# EAGLE board MaTouch ESP32-S3 7.5“ Eink AI Mic Array V1.0 (EAGLE 6.1)
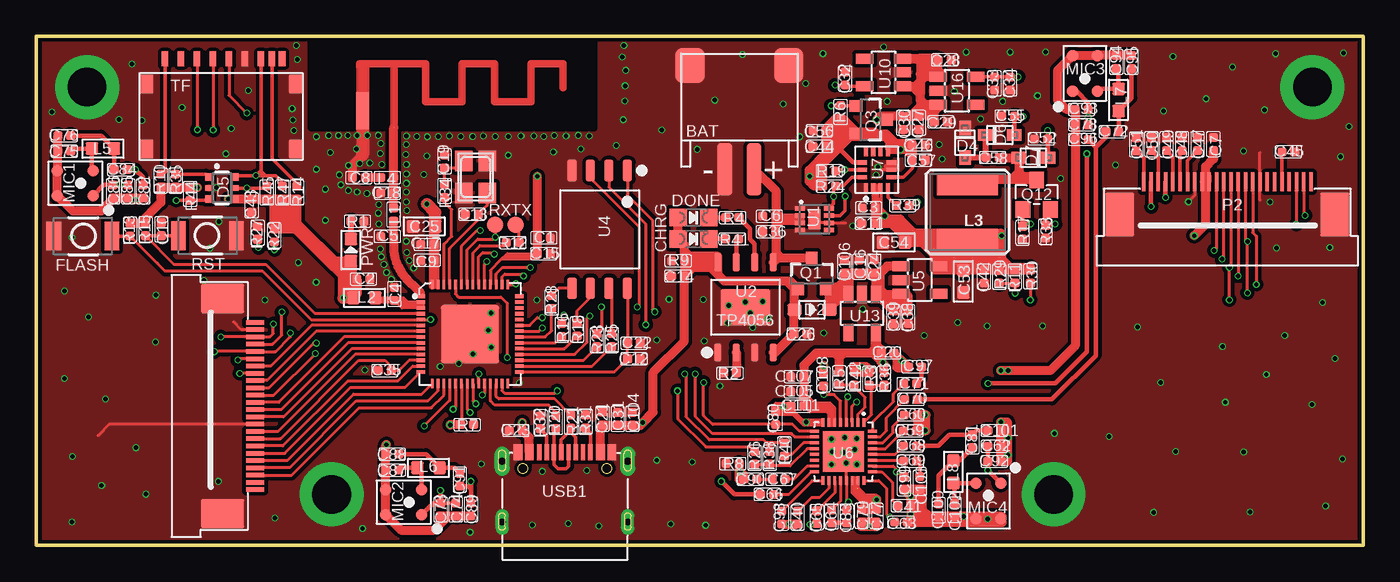
[diagram p3: board, top side]
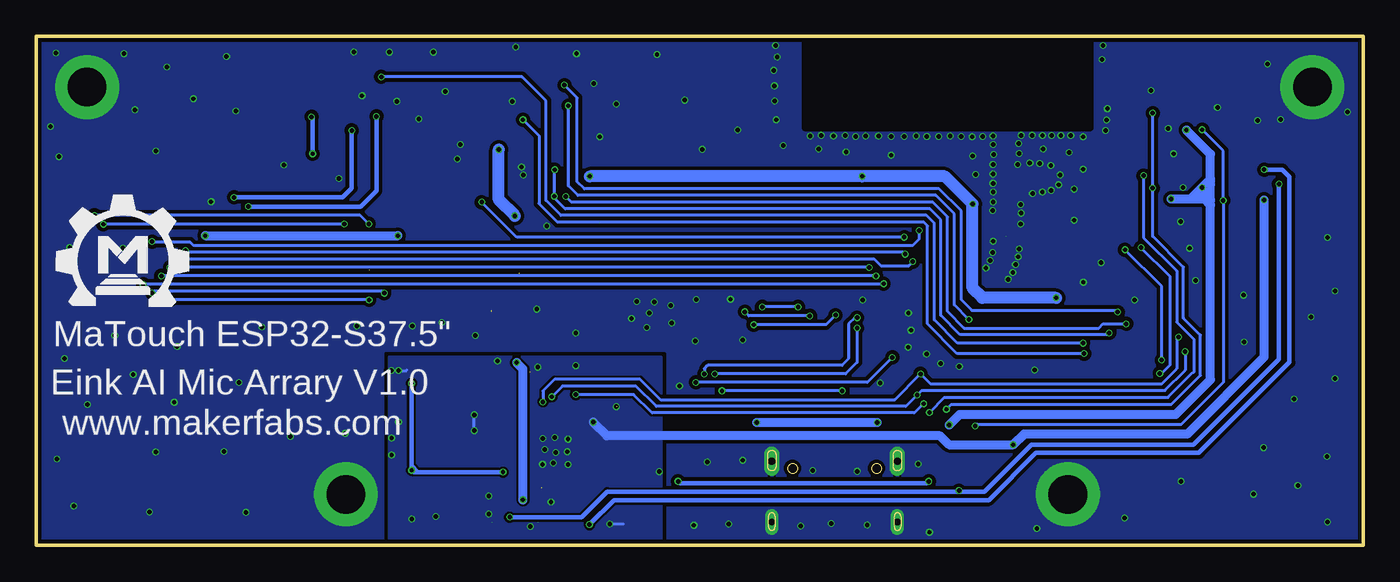
[diagram p4: board, bottom side, seen from below]

Size 91.3 x 35 mm. Coordinates in mm from the lower left corner, seen from the top.
Outline: 0,0 91.3,0 91.3,35 0,35 0,0
Copper layers (1*16): Top 0.035mm / dielectric 1.5mm / Bottom 0.035mm
Design rules: minimum track width 6mil, minimum drill 10mil, track to track 6mil, track to pad 6mil, pad to pad 6mil, via to via 6mil, smd to smd 0mil, copper to edge 10mil, drill to drill 10mil, minimum pad ring 3mil, minimum via ring 3mil, stop-mask expansion 2mil, vias tented up to drill 100mil, thermal gap 0mil
Net classes: 0 default: width 0.203 mm, drill 0.305 mm, clearance 0.152 mm; 1 vbat: width 0.254 mm, drill 0.305 mm, clearance 0.203 mm
tRestrict: area 18.9,28.7 to 38.4,36.3
bRestrict: area 18.8,28.7 to 38.4,36.3

## Footprints (pad centres in the part's own frame; a part is rotated, then mirrored left to right if it is on the bottom)
RN-ANT = smd 0.025 x 0.025: FEED 0,2.159 | smd 2.54 x 0.889: GND -1.143,0
HW2-SMD-2.0-90D = smd 2 x 2.4: 3 3.4,-2.181; 4 -3.4,-2.181 | smd 1 x 3.6: + -1,4.953; - 1,4.953
DISCRETE_C0402 = smd 0.635 x 0.635: 1 -0.445,0; 2 0.445,0
DISCRETE_C0603 = smd 0.889 x 0.889: 1 -0.762,0; 2 0.762,0
C0603 = smd 0.889 x 0.889: 1 -0.762,0; 2 0.762,0
CHIPLED_0805_NOOUTLINE = smd 1.2 x 1.2: A 0,-1.05; C 0,1.05
SOD323 = smd 1 x 0.8: + -1.2,0; - 1.2,0
SOD-323F = smd 1 x 0.8: A -1,0; C 1,0
SOT363 = smd 0.5 x 0.5: 1 -0.75,-0.9; 3 0.75,-0.9; 4 0.75,0.9; 6 -0.75,0.9 | smd 0.4 x 0.5: 2 0,-0.9; 5 0,0.9
157SW = smd 1.016 x 1.981: 1 0,0; 2 4,0
SMD26-50P-1760L450W = smd 0.3 x 1.3: 1 5.75,0; 2 5.25,0; 3 4.75,0; 4 4.25,0; 5 3.75,0; 6 3.25,0; 7 2.75,0; 8 2.25,0; 9 1.75,0; 10 1.25,0; 11 0.75,0; 12 0.25,0; 13 -0.25,0; 14 -0.75,0; 15 -1.25,0; 16 -1.75,0; 17 -2.25,0; 18 -2.75,0; 19 -3.25,0; 20 -3.75,0; 21 -4.25,0; 22 -4.75,0; 23 -5.25,0; 24 -5.75,0 | smd 2 x 3: 25 -7.4,-2.25; 26 7.4,-2.25
DISCRETE_L0402 = smd 0.635 x 0.635: 1 -0.445,0; 2 0.445,0
DISCRETE_L0603 = smd 0.889 x 0.889: 1 -0.762,0; 2 0.762,0
CR54 = smd 4.2 x 1.4: P$1 0,1.85; P$2 0,-1.85
L0603 = smd 0.889 x 0.889: 1 -0.762,0; 2 0.762,0
MIC4-SMD-3.76X2.95MM = smd 0.8 x 0.8: 1 0.85,1.23; 2 0.85,-1.23; 3 -0.85,-1.23; 4 -0.85,1.23
DISCRETE_LED-0603 = smd 0.889 x 0.889: + -0.762,0; - 0.762,0
SOT23-3 = smd 0.8 x 0.9: 1 -0.95,-1; 2 0.95,-1; 3 0,1.1
SOT23 = smd 1.016 x 1.143: 1 -0.95,-1.016; 2 0.95,-1.016; 3 0,1.016
DISCRETE_R0402 = smd 0.635 x 0.635: 1 -0.445,0; 2 0.445,0
TP-D45MIL = smd 1.143 x 1.143: T 0,0
ONEPIN01 = drill 2.65 pad 4.4: 1 0,0
TF-018 = smd 1 x 1.3: 1 -5.15,2.225; 2 -5.15,-2.225; 3 5.15,-2.225; 4 5.15,2.225 | smd 0.5 x 1: G1 -4.2,-3.975; P1 3.85,-3.975; P2 2.75,-3.975; P3 1.65,-3.975; P4 0.55,-3.975; P5 -0.55,-3.975; P6 -1.65,-3.975; P7 -2.75,-3.975; P8 -3.5,-3.975
DFN-8 = smd 0.3 x 0.7: 1 -0.75,-0.99; 2 -0.25,-0.99; 3 0.25,-0.99; 4 0.75,-0.99; 5 0.75,0.99; 6 0.25,0.99; 7 -0.25,0.99; 8 -0.75,0.99 | smd 1.38 x 0.8: 9 0,0
SOP8-1.27P = smd 1.27 x 0.51: 1 -3.1,1.905; 2 -3.1,0.635; 3 -3.1,-0.635; 4 -3.1,-1.905; 5 3.1,-1.905; 6 3.1,-0.635; 7 3.1,0.635; 8 3.1,1.905 | smd 2.5 x 3.4: 9 0,0
QFN56-7*7MM = smd 0.6 x 0.2: 1 -3.4,2.6; 2 -3.4,2.2; 3 -3.4,1.8; 4 -3.4,1.4; 5 -3.4,1; 6 -3.4,0.6; 7 -3.4,0.2; 8 -3.4,-0.2; 9 -3.4,-0.6; 10 -3.4,-1; 11 -3.4,-1.4; 12 -3.4,-1.8; 13 -3.4,-2.2; 14 -3.4,-2.6; 29 3.4,-2.6; 30 3.4,-2.2; 31 3.4,-1.8; 32 3.4,-1.4; 33 3.4,-1; 34 3.4,-0.6; 35 3.4,-0.2; 36 3.4,0.2; 37 3.4,0.6; 38 3.4,1; 39 3.4,1.4; 40 3.4,1.8; 41 3.4,2.2; 42 3.4,2.6 | smd 0.2 x 0.6: 15 -2.6,-3.4; 16 -2.2,-3.4; 17 -1.8,-3.4; 18 -1.4,-3.4; 19 -1,-3.4; 20 -0.6,-3.4; 21 -0.2,-3.4; 22 0.2,-3.4; 23 0.6,-3.4; 24 1,-3.4; 25 1.4,-3.4; 26 1.8,-3.4; 27 2.2,-3.4; 28 2.6,-3.4; 43 2.6,3.4; 44 2.2,3.4; 45 1.8,3.4; 46 1.4,3.4; 47 1,3.4; 48 0.6,3.4; 49 0.2,3.4; 50 -0.2,3.4; 51 -0.6,3.4; 52 -1,3.4; 53 -1.4,3.4; 54 -1.8,3.4; 55 -2.2,3.4; 56 -2.6,3.4 | smd 4 x 4: 57 0,0
SOIC-8-208MIL = smd 1.5 x 0.635: 1 -4.05,1.905; 2 -4.05,0.635; 3 -4.05,-0.635; 4 -4.05,-1.905; 5 4.05,-1.905; 6 4.05,-0.635; 7 4.05,0.635; 8 4.05,1.905
SOT23-5 = smd 0.69 x 1.2: 1 -0.95,-1.3; 2 0,-1.3; 3 0.95,-1.3; 4 0.95,1.3; 5 -0.95,1.3
QFN33-40P400L400W75H-280X280 = smd 0.2 x 0.6: 1 -1.4,-2; 2 -1,-2; 3 -0.6,-2; 4 -0.2,-2; 5 0.2,-2; 6 0.6,-2; 7 1,-2; 8 1.4,-2; 17 1.4,2; 18 1,2; 19 0.6,2; 20 0.2,2; 21 -0.2,2; 22 -0.6,2; 23 -1,2; 24 -1.4,2 | smd 0.6 x 0.2: 9 2,-1.4; 10 2,-1; 11 2,-0.6; 12 2,-0.2; 13 2,0.2; 14 2,0.6; 15 2,1; 16 2,1.4; 25 -2,1.4; 26 -2,1; 27 -2,0.6; 28 -2,0.2; 29 -2,-0.2; 30 -2,-0.6; 31 -2,-1; 32 -2,-1.4 | smd 2.8 x 2.8: 33 0,0
LGA14-50P-300L250W86H = smd 0.675 x 0.28: 1 -1.262,0.75; 2 -1.262,0.25; 3 -1.262,-0.25; 4 -1.262,-0.75; 8 1.262,-0.75; 9 1.262,-0.25; 10 1.262,0.25; 11 1.262,0.75 | smd 0.28 x 0.675: 5 -0.5,-1.012; 6 0,-1.012; 7 0.5,-1.012; 12 0.5,1.012; 13 0,1.012; 14 -0.5,1.012
TYPE-C-31-M-12 = smd 0.3 x 1.1: A5 -1.25,0.05; A6 -0.25,0.05; A7 0.25,0.05; A8 1.25,0.05; B5 1.75,0.05; B6 0.75,0.05; B7 -0.75,0.05; B8 -1.75,0.05 | smd 0.6 x 1.1: GND -3.225,0.05; GND2 3.225,0.05; VBUS1 -2.45,0.05; VBUS2 2.45,0.05 | drill 0.5 pad 1.016 long: P$1 4.32,-0.57; P$2 -4.32,-0.57 | drill 0.45 pad 0.9 long: P$3 -4.32,-4.75; P$4 4.32,-4.75
NX3225 = smd 1.4 x 1.2: 1 -1.1,-0.8; 2 1.1,-0.8; 3 1.1,0.8; 4 -1.1,0.8

## Placement (x,y rotation side)
ANT1  ANTENNA  [RN-ANT]  22.45,28.73 270 top
BAT  JST-2P  [HW2-SMD-2.0-90D]  48.38,30.82 180 top
C1  0.1uF  [DISCRETE_C0402]  34.92,21.14 180 top
C2  0.1uF  [DISCRETE_C0402]  22.5,18.3 180 top
C3  10uF  [DISCRETE_C0402]  57.28,23.2 0 top
C4  0.1uF  [DISCRETE_C0402]  24.64,17.28 270 top
C5  NC  [DISCRETE_C0402]  24.15,21.24 0 top
C6  10uF  [DISCRETE_C0402]  50.43,22.63 180 top
C7  10uF  [DISCRETE_C0402]  81,27.59 270 top
C8  NC  [DISCRETE_C0402]  22.2,25.28 0 top
C9  0.1uF  [DISCRETE_C0402]  26.9,19.59 0 top
C10  0.1uF  [DISCRETE_C0402]  8.61,21.73 270 top
C11  0.1uF  [DISCRETE_C0402]  57.25,22.13 0 top
C12  0.1uF  [DISCRETE_C0402]  41.12,12.82 180 top
C13  12pF  [DISCRETE_C0402]  29.97,22.77 0 top
C14  10uF  [DISCRETE_C0402]  44.15,18.52 180 top
C15  0.1uF  [DISCRETE_C0402]  34.92,20.05 180 top
C16  0.1uF  [DISCRETE_C0402]  56.64,19.16 270 top
C17  0.1uF  [DISCRETE_C0402]  26.9,20.68 0 top
C18  NC  [DISCRETE_C0402]  24.15,24.21 0 top
C19  12pF  [DISCRETE_C0402]  28.09,26.4 90 top
C20  0.1uF  [DISCRETE_C0402]  58.57,13.22 0 top
C21  0.1uF  [DISCRETE_C0402]  38.96,8.7 90 top
C22  1uF/25V  [DISCRETE_C0402]  41.12,13.89 0 top
C23  0.1uF  [DISCRETE_C0402]  32.99,7.89 180 top
C24  10uF  [DISCRETE_C0402]  57.65,19.16 270 top
C25  10uF  [DISCRETE_C0603]  26.69,21.93 0 top
C26  0.1uF  [DISCRETE_C0402]  52.57,14.53 180 top
C27  0.1uF  [DISCRETE_C0402]  60.73,29.05 90 top
C28  10uF  [DISCRETE_C0402]  62.5,33.38 180 top
C29  0.1uF  [DISCRETE_C0402]  62.25,29.11 180 top
C30  10uF  [DISCRETE_C0402]  59.66,29.05 90 top
C31  10uF  [DISCRETE_C0402]  40.01,8.69 270 top
C32  0.1uF  [DISCRETE_C0402]  55.65,32.09 270 top
C33  10uF  [DISCRETE_C0402]  65.94,31.77 90 top
C34  0.1uF  [DISCRETE_C0402]  67,31.77 90 top
C35  15pF  [DISCRETE_C0402]  23.98,12.01 0 top
C36  0.1uF  [DISCRETE_C0402]  50.43,21.57 180 top
C38  10uF  [DISCRETE_C0402]  59.99,15.68 90 top
C39  10uF  [DISCRETE_C0402]  58.96,15.67 270 top
C40  1uF  [DISCRETE_C0402]  52.39,1.9 270 top
C41  1uF  [DISCRETE_C0402]  59.73,2.71 0 top
C42  10uF  [DISCRETE_C0402]  65.21,18.47 90 top
C43  0.1uF  [DISCRETE_C0402]  14.81,23.37 90 top
C44  10uF  [DISCRETE_C0402]  53.88,27.43 0 top
C45  1uF/25V  [DISCRETE_C0402]  86.15,27.06 0 top
C46  1uF/25V  [DISCRETE_C0402]  60.71,27.52 0 top
C47  1uF/25V  [DISCRETE_C0402]  79.9,27.58 90 top
C48  1uF/25V  [DISCRETE_C0402]  78.84,27.58 90 top
C49  1uF/25V  [DISCRETE_C0402]  77.77,27.58 90 top
C50  1uF/25V  [DISCRETE_C0402]  76.73,27.58 90 top
C51  1uF/25V  [DISCRETE_C0402]  75.69,27.56 90 top
C52  1uF/25V  [DISCRETE_C0402]  69.14,27.94 180 top
C53  10uF/25V  [C0603]  63.78,18.14 270 top
C54  10uF/25V  [C0603]  59.01,20.82 180 top
C55  1uF/25V  [DISCRETE_C0402]  66.87,29.51 180 top
C56  0.1uF  [DISCRETE_C0402]  53.89,28.52 0 top
C57  10uF  [DISCRETE_C0402]  60.71,26.48 180 top
C58  1uF/25V  [DISCRETE_C0402]  65.81,26.67 0 top
C59  1uF  [DISCRETE_C0402]  60.11,7.87 0 top
C60  1uF  [DISCRETE_C0402]  60.16,8.96 0 top
C62  1uF  [DISCRETE_C0402]  65.92,6.8 180 top
C63  1uF  [DISCRETE_C0402]  59.5,1.59 180 top
C64  1uF  [DISCRETE_C0402]  54.72,1.97 90 top
C65  1uF  [DISCRETE_C0402]  53.71,1.92 90 top
C66  1uF  [DISCRETE_C0402]  50.29,3.5 0 top
C67  1uF  [DISCRETE_C0402]  51.09,4.54 0 top
C68  1uF  [DISCRETE_C0402]  60.13,6.83 180 top
C69  1uF  [DISCRETE_C0402]  60.13,5.78 180 top
C70  1uF  [DISCRETE_C0402]  60.19,10.03 180 top
C71  1uF  [DISCRETE_C0402]  60.13,11.12 180 top
C72  1uF  [DISCRETE_C0402]  74.04,28.44 0 top
C73  10uF  [DISCRETE_C0402]  27.82,2.45 270 top
C74  100nF  [DISCRETE_C0402]  28.86,2.45 270 top
C75  33pF  [DISCRETE_C0402]  1.92,27.1 180 top
C76  33pF  [DISCRETE_C0402]  1.92,28.17 180 top
C77  1uF  [DISCRETE_C0402]  57.8,2.02 270 top
C78  10uF  [DISCRETE_C0402]  71.93,28.92 180 top
C79  1uF  [DISCRETE_C0402]  56.79,2.02 270 top
C80  33pF  [DISCRETE_C0402]  50.87,8.75 90 top
C81  1uF  [DISCRETE_C0402]  64.42,7.15 270 top
C82  33pF  [DISCRETE_C0402]  7.36,24.33 270 top
C83  33pF  [DISCRETE_C0402]  55.77,1.97 90 top
C84  1uF  [DISCRETE_C0402]  5.81,25.83 180 top
C85  10uF  [DISCRETE_C0402]  6.32,24.33 270 top
C86  100nF  [DISCRETE_C0402]  5.27,24.33 270 top
C87  33pF  [DISCRETE_C0402]  24.49,5.17 180 top
C88  33pF  [DISCRETE_C0402]  24.49,6.26 180 top
C89  33pF  [DISCRETE_C0402]  29.9,2.45 270 top
C90  33pF  [DISCRETE_C0402]  49.14,4.54 180 top
C91  1uF  [DISCRETE_C0402]  29.14,4.51 90 top
C92  10uF  [DISCRETE_C0402]  65.92,5.75 0 top
C93  100nF  [DISCRETE_C0402]  71.93,29.96 180 top
C94  33pF  [DISCRETE_C0402]  74.32,33.24 90 top
C95  33pF  [DISCRETE_C0402]  75.36,33.24 90 top
C96  33pF  [DISCRETE_C0402]  71.93,27.9 180 top
C97  33pF  [DISCRETE_C0402]  60.47,12.26 180 top
C98  1uF  [DISCRETE_C0402]  51.3,1.9 270 top
C99  100nF  [DISCRETE_C0402]  59.7,4.26 270 top
C100  33pF  [DISCRETE_C0402]  62.09,2.4 270 top
C101  33pF  [DISCRETE_C0402]  65.92,7.89 0 top
C102  33pF  [DISCRETE_C0402]  63.18,2.43 270 top
C103  33pF  [DISCRETE_C0402]  60.8,4.29 270 top
C104  10uF  [DISCRETE_C0402]  41.01,8.69 90 top
C105  10uF  [DISCRETE_C0402]  52.36,10.55 180 top
C106  0.1uF  [DISCRETE_C0402]  55.61,19.18 90 top
C107  0.1uF  [DISCRETE_C0402]  52.36,11.6 180 top
C108  33pF  [DISCRETE_C0402]  54.17,11.4 90 top
C111  0.1uF  [DISCRETE_C0402]  52.37,9.56 180 top
CHRG  RED  [CHIPLED_0805_NOOUTLINE]  45.21,21.06 270 top
D2  B5819WS  [SOD323]  53.37,16.19 0 top
D4  MBR0530  [SOD-323F]  63.9,27.68 90 top
D5  SMF05C  [SOT363]  12.78,24.57 270 top
D6  MBR0530  [SOD-323F]  66.3,28.21 180 top
D7  MBR0530  [SOD-323F]  68.61,26.65 0 top
DONE  GREEN  [CHIPLED_0805_NOOUTLINE]  45.21,22.53 270 top
FLASH  BUTTON  [157SW]  1.21,21.26 0 top
J5  [SMD26-50P-1760L450W]  15.06,9.57 270 top
L1  0R  [DISCRETE_L0402]  24.58,22.74 270 top
L2  2nH  [DISCRETE_L0603]  22.57,17.02 0 top
L3  47µH/±30%/1A  [CR54]  64.08,22.92 180 top
L4  NC  [DISCRETE_L0402]  24.15,25.28 0 top
L5  BLM18BD252SN1  [L0603]  4.59,27.28 0 top
L6  BLM18BD252SN1  [L0603]  26.98,5.32 0 top
L7  BLM18BD252SN1  [L0603]  74.47,30.62 270 top
L8  BLM18BD252SN1  [L0603]  63.1,5.04 90 top
MIC1  SAO-3729-M-42-008  [MIC4-SMD-3.76X2.95MM]  2.68,24.89 270 top
MIC2  SAO-3729-M-42-008  [MIC4-SMD-3.76X2.95MM]  25.28,2.96 270 top
MIC3  SAO-3729-M-42-008  [MIC4-SMD-3.76X2.95MM]  72.16,32.45 180 top
MIC4  SAO-3729-M-42-008  [MIC4-SMD-3.76X2.95MM]  65.52,3.04 0 top
P2  [SMD26-50P-1760L450W]  81.95,25 0 top
PWR  [DISCRETE_LED-0603]  21.64,20.3 90 top
Q1  MOSFET-PCHANNEL  [SOT23-3]  53.35,18.64 0 top
Q3  MOSFET-PCHANNEL  [SOT23-3]  57.39,29.26 270 top
Q12  SI1308EDL  [SOT23]  68.83,24.11 0 top
R1  470R  [DISCRETE_R0402]  22.1,22.28 180 top
R2  1.2K  [DISCRETE_R0402]  47.73,11.84 0 top
R3  0R  [DISCRETE_R0402]  57.32,11.45 270 top
R4  1.2K  [DISCRETE_R0402]  47.9,22.53 180 top
R5  NC  [DISCRETE_R0402]  55.26,11.47 270 top
R6  10K  [DISCRETE_R0402]  55.34,29.8 270 top
R7  0R  [DISCRETE_R0402]  29.64,8.29 0 top
R8  0R  [DISCRETE_R0402]  47.92,5.61 180 top
R9  100K  [DISCRETE_R0402]  44.16,19.56 0 top
R10  10K  [DISCRETE_R0402]  8.56,25.07 270 top
R11  NC  [DISCRETE_R0402]  67.33,18.47 90 top
R12  499R  [DISCRETE_R0402]  32.79,20.81 180 top
R13  10K  [DISCRETE_R0402]  6.45,21.71 90 top
R14  10K  [DISCRETE_R0402]  17.94,24.26 270 top
R15  10K  [DISCRETE_R0402]  7.52,21.73 90 top
R16  0R  [DISCRETE_R0402]  36.16,14.81 270 top
R17  10K  [DISCRETE_R0402]  67.86,21.49 270 top
R18  0R  [DISCRETE_R0402]  37.21,14.84 270 top
R19  10K  [DISCRETE_R0402]  54.56,25.74 180 top
R20  33R  [DISCRETE_R0402]  35.73,8.47 270 top
R21  33R  [DISCRETE_R0402]  36.77,8.5 270 top
R22  10K  [DISCRETE_R0402]  16.38,21.31 270 top
R23  0R  [DISCRETE_R0402]  38.58,14.09 270 top
R24  10K  [DISCRETE_R0402]  54.56,24.7 180 top
R25  0R  [DISCRETE_R0402]  39.6,14.1 270 top
R26  0R  [DISCRETE_R0402]  49.42,6.01 90 top
R27  10K  [DISCRETE_R0402]  15.23,21.49 90 top
R28  0R  [DISCRETE_R0402]  35.46,16.72 270 top
R29  10K  [DISCRETE_R0402]  66.26,18.46 270 top
R30  10K  [DISCRETE_R0402]  68.4,18.49 270 top
R31  5.1K  [DISCRETE_R0402]  37.79,8.5 90 top
R32  5.1K  [DISCRETE_R0402]  34.69,8.45 90 top
R33  2.2R  [DISCRETE_R0402]  69.44,21.56 270 top
R34  0R  [DISCRETE_R0402]  28.09,24.37 270 top
R35  10K  [DISCRETE_R0402]  9.58,25.07 270 top
R36  NC  [DISCRETE_R0402]  58.33,11.45 270 top
R38  NC  [DISCRETE_R0402]  50.46,6.01 90 top
R39  NC  [DISCRETE_R0402]  59.61,23.36 0 top
R40  0R  [DISCRETE_R0402]  51.48,6.59 90 top
R41  1.2K  [DISCRETE_R0402]  47.88,21.06 180 top
R42  0R  [DISCRETE_R0402]  56.27,11.47 270 top
R44  10K  [DISCRETE_R0402]  10.59,24.16 90 top
R45  10K  [DISCRETE_R0402]  15.85,24.26 270 top
R47  10K  [DISCRETE_R0402]  16.92,24.26 270 top
RST  BUTTON  [157SW]  13.77,21.29 180 top
RX  [TP-D45MIL]  31.57,22.03 180 top
S1  ONEPIN01  [ONEPIN01]  20.32,3.5 0 top
S2  ONEPIN01  [ONEPIN01]  3.5,31.5 0 top
S3  ONEPIN01  [ONEPIN01]  70,3.5 0 top
S4  ONEPIN01  [ONEPIN01]  87.8,31.5 0 top
TF  TF-018  [TF-018]  12.71,29.49 180 top
TX  [TP-D45MIL]  32.99,22.05 180 top
U1  MAX17048  [DFN-8]  53.54,22.42 270 top
U2  TP4056  [SOP8-1.27P]  48.8,16.36 90 top
U3  ESP32-S3  [QFN56-7*7MM]  29.85,14.52 0 top
U4  W25Q128JV  [SOIC-8-208MIL]  38.76,21.72 270 top
U5  SPX3819  [SOT23-5]  60.79,18.24 270 top
U6  ES7210  [QFN33-40P400L400W75H-280X280]  55.54,6.44 180 top
U7  [LGA14-50P-300L250W86H]  57.84,25.82 90 top
U10  SPX3819-2V8  [SOT23-5]  58.3,32.52 90 top
U13  TLV75733PDBVR  [SOT23-5]  56.82,15.94 180 top
U16  SPX3819-1V2  [SOT23-5]  63.35,31.26 270 top
U$1  [MAKERFABS_0.3]  89.46,16.47 0 bottom
USB1  TYPE-C-31-M-12  [TYPE-C-31-M-12]  36.37,6.35 0 top
X1  40MHz(10ppm)  [NX3225]  30.22,25.33 270 top

## Tracks (layer width: path | path; a pad name or v marks a point on that pad's centre or on a via)
5V  (via drill 0.3)
  Top 0.203: U2.8 46.89,19.36
  Top 0.254: C31.2
  Top 0.61: USB1.VBUS1 33.92,7.41 C23.1 v33.44,8.42 v33.43,8.43 | USB1.VBUS2 38.82,8.12 C21.1 40,8.26 C31.2 | C31.2 C104.1 41.55,8.25 v41.73,8.43 42.44,9.14 42.44,11.89 44.59,14.04 C14.1 | 51.64,18.16 51.88,18.16 Q1.1 | 51.64,18.16 47.35,18.16 46.89,18.62 | U2.4 50.86,13.26 C26.2 52.13,16.15 D2.+ 52.17,17.62 51.64,18.16 | DONE.A CHRG.A 44.61,20.62 R9.2 44.61,18.53 C14.1 | 46.89,18.62 46.89,19.36 46.89,19.86 44.96,19.86 44.6,20.22 44.6,19.66 45.03,19.23 | 46.41,19.23 46.41,19.1 | 46.41,19.1 46.89,18.62 | 46.41,19.1 46.35,19.15 45.23,19.15 C14.1
  Top 0.813: 45.03,19.23 46.41,19.23
  Bottom 0.61: v33.43,8.43 v41.73,8.43
+3V3  (via drill 0.3)  (1 unrouted)
  Top 0.203: TF.P4 v12.16,28.55 v12.17,28.55 | U3.46 31.25,18.9 32.03,19.68 | 32.21,19.86 32.39,20.05 C15.2 34.04,20.05 | U3.55 27.65,22.24 27.45,22.43 27.34,22.31 C17.2 C9.2 | U3.56 27.25,21.72 C25.2 | 34.52,19.86 32.21,19.86 | 32.21,19.86 32.03,19.68 | 32.03,19.68 34.52,19.68 34.67,19.84 | 16.38,23.76 16.43,23.82 | U3.20 29.25,8.34 R7.1 | 64.3,21.29 L3.P$1 | 57.56,24.77 57.56,24.05 | 57.56,24.05 57.56,22.61 57.56,22.45 58.29,22.45 | 58.37,22.45 58.29,22.45 | 58.29,22.45 58.01,22.73 58.01,23.39 57.91,23.5 57.91,23.67 | 57.91,23.67 57.91,24.66 57.73,24.66 57.73,24.33 57.71,24.31 | 57.56,24.79 58.12,24.79 58.12,23.88 | 58.12,23.88 58.12,22.86 58.65,22.33 | 58.12,23.88 57.91,23.67 | v59.49,27.2 59.81,27.52 C46.1 | 57.72,24.2 57.58,24.05 57.56,24.05 | 57.94,23.39 57.74,23.2 C3.2 | R10.2 8.74,24.62
  Top 0.254: D5.4 C43.2 R45.2 16.43,23.82 R47.2 R14.2 | U7.2 U7.3 57.72,24.2 C3.2 | U7.5 59.66,25.32 60.27,25.93 60.27,26.46 C57.2 C46.1 59.02,27.52 U7.8 58.6,27.1 58.6,27.84 58.12,28.31 Q3.2
  Top 0.305: 27.25,21.72 27.43,21.53 27.43,17.78 27.18,17.78 27.18,23.11 27.13,23.16 | U7.12 56.2,26.32 54.94,27.58 54.48,27.58 C44.2 | 57.94,23.39 57.94,23.29 58.9,22.33 | v58.37,22.66 58.32,22.61 57.56,22.61 | P2.16 P2.15 80.7,25.39 80.47,25.63
  Top 0.61: C2.2 22.06,17.26 L2.1 | v34.47,25.38 v34.48,25.36 C1.2 C15.2 | 21.09,16.98 v21.13,17.02 | 16.38,23.76 R22.1 17.86,21.74 20.06,19.54 | 8.74,24.62 R35.2 10.56,24.63 R44.2 v11.07,24.61 | R15.2 7.5,22.15 R13.2 7.14,22.15 8.56,23.58 R10.2 | v13.21,23.82 17.93,23.82 R14.2 | PWR.+ 20.06,19.54 | R24.2 54.12,25.25 | 54.12,25.25 R19.2 54.12,26.51 54.33,26.72 C44.2 54.33,28.51 C56.2 54.55,28.31 55.45,28.31 | v53.21,25.38 53.99,25.38 54.12,25.25 | R30.1 67.35,18.93 R11.2 66.28,18.92 R29.1 C42.2 63.8,18.91 C53.1 | C53.1 63.78,20.57 | 63.78,20.57 63.78,20.77 L3.P$1 | U5.5 63.5,19.19 C53.1 | 63.78,20.57 63.53,20.82 C54.1 59.77,21.82 59.45,22.13 C11.2 57.72,22.16 C3.2 | v66.42,21.29 64.3,21.29 | v79.68,21.29 80.47,22.07 80.47,25.63 80.47,26.04 81,26.57 C7.2 | Q3.2 55.45,28.31 | R6.2 55.34,28.43 55.45,28.31 | 54.03,24.69 53.52,24.69 53.19,25.02 53.19,25.81 54.33,26.95 54.33,28.68 55.02,29.36 55.47,29.36 56.41,28.42 57.66,28.42 57.78,28.3 58.47,28.3 59.11,27.66 60.27,27.66 60.27,26.8 | 60.27,26.47 60.27,26.8 | 60.27,26.8 59.87,27.2 v59.49,27.2 58.75,27.2 58.75,27.76 58.42,28.09 55.98,28.09 53.75,25.86 | 53.75,25.86 53.75,24.94 | 53.75,25.86 53.75,26.19 55.5,27.94 55.5,28.78 55.04,28.78 54.84,28.57 54.84,27.53 | 63.98,21.03 63.55,21.46 60.4,21.46 59.44,22.43 58.57,22.43 | 58.57,22.43 58.24,22.76 | 58.57,22.43 59.64,21.36 59.64,20.73 60.02,21.11 65.23,21.11 65.58,21.46 66.37,21.46 66.42,21.41 66.42,19.68 66.98,19.13 68.4,19.13 R30.1 61.8,18.92 61.8,19.99 60.94,20.85 61.62,20.85 62.2,20.27 65.99,20.27 65.99,19.68 66.32,19.36 62.66,19.36 62.15,19.86 65.76,19.86 65.81,19.81 | R7.1 28.48,8.29 v28.47,8.28
  Top 0.61: 20.06,19.54 21.03,18.57 | 21.03,18.57 21.03,16.99 | 21.03,18.57 21.03,19.25 20.83,19.25 17.96,22.12 17.96,23.82 17.48,23.34 17.48,22.25 16.82,22.25 16.92,22.35 16.92,23.44 17.12,23.65 17.45,23.65
  Top 0.813: C25.2 27.45,22.43 27.45,22.9 v26.88,23.47 | v21.13,17.02 L2.1 21.64,17.19 PWR.+
  Bottom 0.61: 10.52,23.39 10.52,11.38 12.9,8.99 27.76,8.99 v28.47,8.28 | 10.52,23.72 10.52,23.75 | 10.52,23.75 10.52,24.82 | 10.52,24.82 10.52,25.04 | 10.52,25.04 10.52,25.17 | 10.52,25.17 10.52,26.9 v12.17,28.55 | v11.07,24.61 10.72,24.61 10.52,24.82 | v13.21,23.82 11.86,23.82 | 10.95,23.82 10.59,23.82 10.52,23.75 | v79.68,21.29 v66.42,21.29 | 10.52,25.04 10.64,25.04 v11.07,24.61 | v11.07,24.61 11.86,23.82 | 11.86,23.82 10.95,23.82 | 10.95,23.82 10.52,23.39 | 10.52,23.39 10.52,23.72 | 10.52,23.72 11.1,24.31 11.1,24.59 10.52,25.17
  Bottom 0.813: v53.21,25.38 v34.47,25.38 28.79,25.38 v26.88,23.47 26.88,17.69 26.21,17.02 v21.13,17.02 | v58.37,22.66 59.49,23.77 v59.49,27.2
AGND  (via drill 0.3)  (4 unrouted)
  Top 0.203: U6.33 55.74,6.24 U6.21 55.74,2.92 | 55.74,2.92 55.74,2.45 C83.2 | C59.2 v61.16,7.87 | v61.16,8.97 60.63,8.97 | U6.8 52.64,8.44 51.89,9.19 | 51.89,9.19 51.38,9.19 | 51.38,9.19 C80.2 | v55.88,2.97 55.79,2.97 55.74,2.92 | v51.38,9.53 51.38,9.19 | 51.89,9.19 51.92,9.22 C111.2 | 54.1,8.26 52.78,8.26 52.07,8.97 50.65,8.97 50.65,9.55 50.88,9.78 52.09,9.78 52.15,9.73 52.15,9.2 52.7,8.64 | 52.7,8.64 54.13,8.64 | 52.7,8.64 52.58,8.64 52.05,9.17 51.16,9.17 50.8,9.53 50.93,9.65 51.56,9.65 51.56,9.32 51.36,9.53 50.98,9.53 51.13,9.37 51.46,9.37
  Top 0.305: 57.3,1.55 57.28,1.57 | 59.97,12.26 C97.2
  Top 0.61: C98.2 C40.2 52.2,1.45 v51.84,1.45 | R42.1 56.81,11.9 | 56.81,11.9 R3.1 | C77.2 57.28,1.57 C79.2 | v57.3,1.29 57.3,1.55 | C20.2 59.65,12.58 | 59.65,12.58 59.97,12.26 | C108.2 54.18,11.85 v54.18,12.34 | v56.79,12.24 56.81,12.23 56.81,11.9 | 59.65,12.58 59.65,12.59 v59.56,12.68 60.02,12.22 59.23,12.22 59.21,12.24 59.21,12.88 59,13.08 59,13.23 | 60.63,8.97 60.63,7.87 61.21,7.87 61.21,8.97 60.61,8.97 C60.2 | C92.2 C62.1 C101.2 v66.37,8.48 66.8,8.48 66.8,5.74 C92.2 | MIC4.2 MIC4.3 64.49,1.98 v63.8,1.98 C102.2 63.16,1.96 C100.2 60.31,1.96 C63.1 60.17,1.82 C41.2 60.17,3.77 60.22,3.81 | C99.2 60.22,3.81 | 60.22,3.81 60.77,3.81 C103.2 | R8.1 48.36,5.13 v48.44,5.05 | C90.2 48.69,4.8 v48.44,5.05 | C95.2 C94.2 MIC3.3 MIC3.2 70.28,32.66 70.28,30.61 70.93,29.96 C93.2 C78.2 C96.2 71.49,13.73 69.77,12.01 v66.37,12.01 | C89.2 C74.2 28.32,2 | 28.32,2 C73.2 | 28.32,2 27.36,1.04 25.12,1.04 MIC2.2 MIC2.3 C87.2 C88.2 24.05,6.88 v24.08,6.91 | C86.2 C85.2 | C85.2 6.81,23.89 | 6.81,23.89 C82.2 | v6.83,23.75 6.83,23.86 6.81,23.89 | C85.2 5.35,23.89 4.45,22.99 2.51,22.99 MIC1.2 MIC1.3 1.48,25.77 C75.2 C76.2 | 56.29,12.09 56.26,12.06 | 56.26,12.06 56.26,11.94 | 56.26,12.06 56.26,12.29 57.07,12.29 57.33,12.04 57.33,11.91 | 48.36,5.46 48.36,4.52 48.69,4.52 48.69,4.8 v48.44,5.05 | 59.94,1.57 66.45,1.57 66.45,1.98 61.42,1.98 60.98,2.41 60.98,3.86 59.69,3.86 59.69,3.83 60.15,3.38 60.58,3.38 60.58,2.03 | 56.77,1.57 56.77,1.29 57.81,1.29 C77.2
  Bottom 0.203: v61.16,7.87 v61.16,8.97 | 50.9,1.45 v51.84,1.45 | v66.37,12.01 65.84,12.01 65.81,12.04
  Bottom 0.61: v6.83,23.75 6.83,12.93 12.12,7.64 23.32,7.64 24.05,6.91 v24.08,6.91 28.5,6.91 29.11,7.52 52.05,7.52 v52.98,8.46
  other vias: 56.31,6.58 54.71,7.29 55.63,7.42 54.76,6.43 54.71,5.54 55.73,5.66 55.55,6.38 56.46,5.56 56.44,7.34 60.17,3.38 60.17,2.13 65.46,1.8 66.85,7.37 66.85,6.2 66.88,12.01
  pour Bottom: 48.29,12.93 67.03,12.93 67.03,0 48.29,0
CSI_1V2  (via drill 0.3)
  Top 0.203: J5.15 16,10.82 19.07,13.89 v19.28,13.89 | C33.2 | C34.2 | v67.56,32.21
  Top 0.254: U16.5 C33.2 C34.2 | C34.2 v67.56,32.21
  Bottom 0.203: v19.28,13.89 27.91,13.89 29.52,15.49 29.52,22.15 30.05,22.68 55.19,22.68 56.24,23.72 56.24,30.56 57.89,32.21 v67.56,32.21
CSI_2V8  (via drill 0.3)
  Top 0.203: 55.73,31.57 C32.2 | v16.89,16.03 16.89,14.45 16.26,13.82 J5.21
  Top 0.254: U10.5 55.73,31.57 | v54.97,31.65 C32.2
  Bottom 0.203: v54.97,31.65 54.08,30.76 54.08,24.99 53.59,24.51 29.18,24.51 27.66,22.99 27.66,16.89 26.92,16.15 17.02,16.15 v16.89,16.03
CSI_D0
  Top 0.203: J5.6 17.09,6.32 21.61,10.85 25.37,10.85 U3.14
CSI_D1
  Top 0.203: J5.4 15.07,5.33 17.42,5.33 22.02,9.93 26.95,9.93 27.65,10.63 U3.16
CSI_D2
  Top 0.203: J5.3 17.57,4.82 22.2,9.45 27.18,9.45 28.05,10.32 U3.17
CSI_D3
  Top 0.203: J5.5 17.25,5.82 21.82,10.39 26.52,10.39 U3.15
CSI_D4
  Top 0.203: J5.7 16.96,6.82 21.44,11.3 24.89,11.3 25.91,12.32 U3.13
CSI_D5
  Top 0.203: J5.9 16.64,7.82 21.93,13.12 U3.11
CSI_D6
  Top 0.203: U3.10 21.7,13.52 17,8.82 J5.11
CSI_D7
  Top 0.203: U3.8 21.18,14.32 16.68,9.82 J5.13
CSI_HSYNC
  Top 0.203: U3.7 19.27,14.72 15.88,11.33 J5.16
CSI_MCLK
  Top 0.203: U3.9 21.44,13.92 16.84,9.32 J5.12
CSI_PCLK
  Top 0.203: J5.8 16.8,7.32 22.19,12.72 23.98,12.72 24.42,12.28 C35.2 | C35.2 24.43,12.02 | U3.12 25.65,12.72 24.93,12.01 C35.2
CSI_RST  (via drill 0.3)
  Top 0.203: R22.2 v16.38,20.33 v16.38,20.32 | J5.19 13.96,12.82 v13.87,12.72
  Bottom 0.203: v13.87,12.72 13.87,17.8 v16.38,20.32
CSI_VSYNC
  Top 0.203: U3.6 18.93,15.12 16.13,12.32 J5.18
GDR  (via drill 0.3)
  Top 0.203: P2.2 87.2,22.78 v87.3,22.68
  Top 0.305: Q12.1 67.86,23.08 R17.1 68.03,22.1 v68.43,22.1
  Bottom 0.203: v68.43,22.1 69.01,22.68 v87.3,22.68
GND  (via drill 0.3)
  Top 0.203: 21.74,25.29 C8.1 | J5.10 5.02,8.32 4.24,7.54 | J5.23 14.11,14.82 13.56,15.37 | U3.57 30.41,14.52 v31.32,13.61 | U1.6 53.79,22.17 U1.9 | U1.6 55.7,22.17 | 84.2,27.03 84.2,27.02 84.2,25.75 P2.8 84.2,23.73 | P2.17 79.7,24.07 79.32,23.7 | v57.91,26.01 58.1,25.82 U7.6 58.95,25.82 59.2,26.08
  Top 0.305: 59.2,26.08 58.45,26.08
  Top 0.61: 22.45,26.86 21.74,26.14 21.74,25.29
  Top 0.889: ANT1.GND 22.45,26.86
  other vias: 21.49,26.11 12.52,4.39 43.66,1.45 87.78,9.68 88.49,16.69 24.43,18.29 11.53,18.21 25.5,20.14 23.93,19.3 40.49,30.56 30.02,28.12 45.9,16.89 26.67,25.5 23.55,28.19 12.4,24.61 73.81,7.47 23.55,22.83 22.76,24.18 29.21,28.12 30.76,28.14 26.9,28.09 28.42,28.14 4.75,10.06 27.66,28.12 22.07,28.17 84.63,11.73 76.89,2.26 34.24,28.14 22.61,12.04 19.89,24.49 65.43,15.09 75.77,15.01 78.38,6.45 30.05,13.16 45.14,5.71 38.71,1.32 34.82,5.08 37.87,5.13 36.6,1.5 33.35,28.14 34.92,28.12 35.59,27.05 47.57,15.29 36.45,28.14 20.85,25.48 22.07,24.28 6.58,33.1 23.75,19.84 15.72,16.87 1.07,29.79 5.69,29.29 17.91,34.37 13.06,26.92 10.03,30.1 19.28,28.09 20.12,28.17 22.25,26.26 7.26,29.21 21.44,28.17 22.78,28.19 23.77,26.19 25.45,24.28 25.45,23.6 8.2,13.97 23.57,22.1 20.95,24.79 23.57,23.44 25.96,19.08 23.7,27.64 25.43,26.87 25.68,19.58 46.05,1.37 2.49,6.1 25.45,27.56 3.58,15.7 12.57,22.25 25.48,25.53 25.45,20.9 25.48,24.89 25.48,26.19 23.67,26.95 7.54,3.51 25.48,28.14 22.02,27.25 21.46,24.41 23.67,20.37 38.05,28.14 37.29,28.19 24.1,18.75 35.64,28.17 39.9,27.48 89.36,12.85 81.61,13.67 89.89,5.92 22.94,26.29 83.08,6.4 14.61,31.27 17.65,29.24 48.77,16.74 1.93,17.48 4.5,4.11 37.47,27.25 13.41,28.65 25.5,23.01 18.03,19.43 85.9,14.43 8.23,17.2 81.81,9.83 26.19,28.12 32.49,26.82 77.37,11.2 1.93,11.46 6.86,6.71 49.99,16.76 49.3,14.96 31.57,28.12 30.63,5.59 43.54,16.92 29.84,0.89 42.7,5.84 42.7,14.12 16.41,1.88 34.14,1.4 22.45,1.14 20.8,28.17 88.72,2.69 20.24,27 26.87,26.77 2.46,1.6 49.12,15.98 40.31,33.58 47.65,16.48 45.95,14.05 32.49,28.12 70.05,7.7 83.52,2.29 2.46,21.16 50.34,15.6 54.18,14.61 56.87,16.23 61.09,14.43 69.24,15.09 63.4,15.32 56.18,21.95 46.69,30.61 51.38,30.35 43.03,28.55 54.13,33.81 48.59,33.76 58.32,34.26 58.55,30.53 57.78,25.45 62.13,27.56 62.33,26.57 63.17,31.22 63.98,33.91 67.01,33.91 68.88,30.91 69.44,33.93 66.5,30.53 64.97,29.31 70.48,25.22 74.27,26.16 79.27,23.62 83.06,27.1 78.21,33.6 77.57,29.87 82.32,32.89 80.49,30.71 85.27,33.81 90.32,28.8 89.94,33.86 89.74,26.72 84.51,29.95 89,20.47 85.34,20.45 84.89,23.6 19.25,18.08 11.94,20.42 19.89,22.35 19.28,25.86 47.04,10.95 52.53,28.09 52.93,31.75 45.47,27.23 31.29,15.98 27.79,12.29 29.08,12.5 31.11,14.78 33.22,11.15 34.44,16.87 40.39,29.26 40.51,31.6 40.56,32.66 40.44,34.37 17.73,28.52 17.6,30.02 17.96,33.4
  pour Top (isolate 0.254, rank 6): -10,50 -10,-5 100,-5 100,50
  pour Bottom (isolate 0.254, rank 6): -11,-5 101,-5 101,48 -11,48
IO0  (via drill 0.3)
  Top 0.203: R13.1 8.32,19.39 8.76,18.95 8.87,18.85 15.57,18.85 18.9,15.52 U3.5 v27.13,15.52 | 54.7,30.24 v54.69,30.23 | 56.37,30.24 Q3.1
  Top 0.254: FLASH.2 | FLASH.2 R13.1 | 54.7,30.24 R6.1 56.37,30.24
  Bottom 0.203: v54.69,30.23 54.69,24.71 54.03,24.05 29.41,24.05 28.14,22.78 28.14,16.54 v27.13,15.52
IO13  (via drill 0.3)
  Top 0.203: U3.18 28.45,9.95 v26.7,8.2 | TF.P3 11.06,28.59 v11.07,28.57 | 10.61,23.74 R44.1
  Top 0.254: D5.3 11.81,23.74 10.61,23.74 | R44.1 v9.63,23.72
  Bottom 0.203: v11.07,28.57 9.63,27.13 v9.63,23.72 9.63,11.2 12.5,8.33 26.57,8.33 v26.7,8.2
IO14  (via drill 0.3)
  Top 0.203: U3.19 28.85,9.52 v28.68,9.35 | TF.P5 13.26,30.93 v14.48,29.72
  Top 0.254: D5.5 v14.48,24.57 15.71,24.57 R45.1
  Bottom 0.203: v14.48,29.72 v14.48,24.57 14.48,21.23 12.37,19.13 12.37,15.62 11.2,14.45 11.2,11.68 13.21,9.68 28.35,9.68 v28.68,9.35
IO15  (via drill 0.3)
  Top 0.203: 15.95,25.43 15.77,25.43 | 15.44,25.76 15.44,25.48 15.47,25.45 | U3.21 29.65,9.32 v29.84,9.12
  Top 0.254: TF.P7 15.46,25.78 15.44,25.76 | R47.1 16.92,24.96 16.46,25.43 15.95,25.43 v15.11,25.43 | D5.6 13.79,25.43 v15.11,25.43 | 15.44,25.76 v15.11,25.43 | 15.77,25.43 15.44,25.76
  Bottom 0.203: v15.11,25.43 15.11,21.16 12.83,18.87 12.83,15.34 11.66,14.17 11.66,11.89 11.71,11.89 13.44,10.16 28.8,10.16 v29.84,9.12
IO16  (via drill 0.3)
  Top 0.203: U6.5 55.34,9.91 54.89,10.36 v54.18,10.36 54.17,10.38 C108.1 | U3.22 30.05,9.93 v30.25,9.73
  Bottom 0.203: v54.18,10.36 50.19,10.36 48.92,9.09 30.89,9.09 v30.25,9.73
IO17/I2C_SDA  (via drill 0.3)
  Top 0.203: R24.1 54.86,24.56 | v16.31,15.21 16.31,14.55 16.07,14.32 J5.22 v12.7,14.32 v12.7,14.33 | U6.3 56.14,9.55 v56.44,9.86 | U3.23 30.45,11.78 v30.45,11.79
  Top 0.254: U7.14 56.13,25.32 55.52,24.71 55.02,24.71 R24.1 | 54.69,23.17 U1.8 54.86,23.5 v54.86,23.98 54.86,24.56
  Bottom 0.203: v54.86,23.98 54.48,23.6 29.62,23.6 28.6,22.58 28.6,16.08 27.46,14.94 18.19,14.94 17.91,15.21 v16.31,15.21 | v12.7,14.33 12.83,14.2 12.83,12.14 13.87,11.1 29.77,11.1 v30.45,11.79 32.23,10.01 48.36,10.01 49.76,11.4 55.65,11.4 56.44,10.62 v56.44,9.86
IO18/I2C_SCL  (via drill 0.3)
  Top 0.203: v17.48,14.61 17.48,14.33 16.46,13.31 15.07,13.31 J5.20 12.26,13.32 v12.24,13.31 | U6.4 55.74,10.12 v55.83,10.21 | U3.24 30.85,10.5 v30.68,10.34
  Top 0.254: U7.13 v55.63,25.82 55.09,25.82 R19.1 | U1.7 55.31,22.67 55.65,23.01 v55.65,24
  Bottom 0.203: v55.63,25.82 55.65,25.8 v55.65,24 55.65,23.88 54.91,23.14 29.82,23.14 29.06,22.38 29.06,15.8 27.74,14.48 17.6,14.48 v17.48,14.61 | v12.24,13.31 12.24,12.04 13.64,10.64 30.38,10.64 v30.68,10.34 31.47,9.55 48.64,9.55 50.04,10.95 55.09,10.95 v55.83,10.21
IO19
  Top 0.203: R20.1 35.73,9.15 35.26,9.63 31.55,9.63 31.25,9.93 U3.25
IO20
  Top 0.203: R21.1 35.66,10.06 31.83,10.06 31.65,10.24 U3.26
IO21  (via drill 0.3)
  Top 0.203: U3.27 32.05,10.63 32.21,10.46 35.69,10.46 v35.84,10.62 | R26.2 49.12,6.76 46.08,6.76 44.12,8.71 v44.12,10.62
  Bottom 0.203: v35.84,10.62 v44.12,10.62
IO38  (via drill 0.3)
  Top 0.203: P2.9 83.7,21.51 83.95,21.26 v83.95,17.93 | U3.43 32.93,17.92 v32.99,17.98
  Bottom 0.203: v32.99,17.98 33.05,17.93 v83.95,17.93
IO39  (via drill 0.3)
  Top 0.203: P2.11 v82.7,18.52 | U3.44 32.05,18.46 32.23,18.64 33.4,18.64 v33.53,18.52
  Bottom 0.203: v33.53,18.52 v82.7,18.52
IO40  (via drill 0.3)
  Top 0.203: P2.12 82.2,19.21 v82.09,19.1 v82.09,16.87 | U3.45 31.65,18.67 32.08,19.1 v33.98,19.1 | R30.2 v68.4,16.87
  Bottom 0.203: v33.98,19.1 v82.09,19.1 | v68.4,16.87 v82.09,16.87
IO41  (via drill 0.3)
  Top 0.203: P2.13 81.69,24.98 81.69,19.79 v81.58,19.68 | U3.47 30.85,19.36 v30.99,19.51
  Bottom 0.203: v81.58,19.68 33.66,19.68 33.2,19.23 31.27,19.23 v30.99,19.51
IO42  (via drill 0.3)
  Top 0.203: P2.14 81.2,20.42 v81.05,20.27 | U3.48 30.45,19.85 30.71,20.12 31.42,20.12 v31.52,20.02
  Bottom 0.203: v31.52,20.02 31.65,20.14 80.92,20.14 v81.05,20.27
IO45  (via drill 0.3)
  Top 0.203: U3.51 29.25,20.58 30.3,21.64 v30.56,21.64 | P2.10 83.2,20.99 83.31,20.88 v83.34,20.88 v83.34,17.35 | 67.32,18.02 67.32,17.37 v67.36,17.33 | R29.2 67.32,18.02 | 67.32,18.02 R11.1
  Bottom 0.203: v30.56,21.64 30.56,21.06 31.01,20.6 80.47,20.6 80.72,20.85 83.31,20.85 v83.34,20.88 | 83.32,17.33 v83.34,17.35 83.24,17.45 67.48,17.45 v67.36,17.33
IO46  (via drill 0.3)
  Top 0.203: U3.52 28.85,17.28 29.06,17.07 31.98,17.07 32.4,16.65 v32.4,12.92 | U6.9 52.51,7.84 52.05,8.31 C80.1 46.53,8.31 45.92,8.91 v45.92,11.2
  Bottom 0.203: v32.4,12.92 34.12,11.2 v45.92,11.2
IO47  (via drill 0.3)
  Top 0.203: U3.37 33.94,15.12 34.47,15.65 v34.82,15.65 | U6.10 52.2,7.44 51.97,7.67 46.53,7.67 45.34,8.87 v45.34,11.79
  Bottom 0.203: v34.82,15.65 34.98,15.65 35.41,15.21 35.41,12.83 35.87,12.37 45.11,12.37 45.34,12.14 v45.34,11.79
IO48  (via drill 0.3)
  Top 0.203: U3.36 34.61,14.72 v34.82,14.94 | v44.63,11.79 44.7,11.71 44.7,8.84 46.3,7.24 50.04,7.24 50.24,7.04 | 50.24,7.04 50.33,6.95 | 50.33,6.95 50.46,6.82 R38.2 | R40.2 50.24,7.04 | 50.7,7.04 50.55,6.88 50.55,6.53 arc-90 50.33,6.74 50.33,6.95
  Bottom 0.203: v34.82,14.94 34.82,12.57 35.61,11.79 v44.63,11.79
MIC_1N
  Top 0.203: C90.1 C67.1
MIC_1P  (via drill 0.3)
  Top 0.305: C89.1 29.9,3.86 | 29.9,3.86 v29.9,4.39 | C91.1 29.7,4.06 29.9,3.86 | C66.1 48.04,3.5 v47.14,4.39
  Bottom 0.305: v29.9,4.39 30.02,4.27 47.02,4.27 v47.14,4.39
MIC_2N
  Top 0.305: C83.1 C64.1
MIC_2P  (via drill 0.3)
  Top 0.203: C84.1
  Top 0.254: 7.34,24.79 C82.1
  Top 0.305: 7.34,24.79 7.34,25.3 v6.81,25.83 C84.1 | v53.24,1.42 53.29,1.48 C65.1
  Bottom 0.305: v6.81,25.83 5.56,25.83 5.08,25.35 5.08,12.57 11.3,6.35 22.5,6.35 25.76,3.1 51.56,3.1 v53.24,1.42
MIC_3N
  Top 0.305: C97.1 60.91,11.45 C71.1
MIC_3P
  Top 0.203: 69.9,10.03 C70.1
  Top 0.305: C96.1 72.9,27.38 | 72.9,27.38 72.9,13.03 69.89,10.03 C70.1 | C72.1 73.59,28.07 72.9,27.38
MIC_4N
  Top 0.254: C103.1 60.8,5.57 C69.1
MIC_4P
  Top 0.254: C81.1
  Top 0.305: C68.1 62.07,6.83 62.84,7.59 C81.1 | C101.1 64.72,7.89 C81.1
MKF_3V3  (via drill 0.3)  (1 unrouted)
  Top 0.152: U6.7 arc90 U6.7 54.53,8.26
  Top 0.203: U6.7 54.54,9.01 54.38,9.17 53.2,9.17 C111.1 | U6.6 54.94,9.45 54.63,9.75 53.57,9.75 52.8,10.52 C105.1 | 54.53,8.26 54.84,8.26 | 54.91,8.26 54.84,8.26 | 54.84,8.26 54.74,8.36 | v57.81,3.12 57.38,3.12 56.54,3.96 U6.23 U6.22 56.14,3.6 56.79,2.95 C79.1 C77.1 | 58.33,12.43 58.33,12.48 | 58.33,12.48 v58.26,12.56 | 54.69,13.16 54.93,12.92 | 54.93,12.92 55.24,12.6 55.83,13.18 | 55.19,13.22 55.19,13.18 54.93,12.92 | 57,13.13 57.53,13.66 57.53,14.91 58.01,14.91 58.01,13.87 58.34,13.54 58.34,12.7 | 58.34,12.7 58.47,12.57 58.38,12.48 58.33,12.48 | 58.34,12.7 58.14,12.9 58.14,13.64
  Top 0.305: 54.74,8.36 54.74,9.09 54.48,9.35 53.26,9.35 53.01,9.6 53.01,9.98 53.44,9.55 54.56,9.55 54.81,9.3 | 56.34,4.6 56.34,3.73 57.02,3.05 57.02,2.31 57.96,2.31 57.96,3.23 57.78,3.4 57.02,3.4 56.52,3.91 56.52,3.68 57.05,3.15 57.73,3.15 57.73,2.85 57.68,2.9 57.2,2.9 57.2,2.62 57.63,2.62
  Top 0.61: 55.19,13.22 C20.1 58.12,13.21 58.12,12.7 | 55.19,13.22 53.65,13.22 52.81,12.37 C107.1 | C107.1 | C107.1 C105.1 52.8,9.57 C111.1 | R5.1 55.26,13.15 55.19,13.22 | R36.1 58.33,12.43 58.12,12.65 58.12,12.7 | U13.5 57.77,13.04 58.12,12.7
  Bottom 0.61: v57.81,3.12 57.81,12.12 v58.26,12.56
N$1
  Top 0.61: L1.1 24.59,24.2 C18.2 L4.2 24.6,28.72 ANT1.FEED
N$2  (1 unrouted)
  Top 0.203: U3.1 26.45,17.35 26.12,17.67
  Top 0.61: 24.59,21.24 24.59,20.55 arc45 25.53,18.27 26.12,17.67 26.44,17.36 | C5.2 24.6,22.28 L1.2
N$3
  Top 0.203: U3.35 35.02,14.32 35.46,14.76 R28.2
N$4
  Top 0.61: L4.1 C8.2
N$5
  Top 0.254: USB1.A5 35.12,7.58 R32.1
N$6
  Top 0.254: P2.5 85.7,27.05 C45.1
N$7
  Top 0.203: PWR.- 21.65,21.08
  Top 0.406: 21.65,21.08 R1.2
N$8
  Top 0.254: P2.19 78.7,27 C48.1
N$9
  Top 0.254: P2.20 78.2,26.7 C49.1
N$10
  Top 0.254: P2.22 77.2,26.66 C50.1
N$11
  Top 0.406: D4.A 63.92,26.67 C58.1 65.3,26.73 D6.C
N$12
  Top 0.61: U2.2 R2.2
N$13
  Top 0.305: U2.7 48.16,20.9 R41.1
N$14
  Top 0.305: U2.6 49.43,20.75 49.12,21.06 49.12,21.76 R4.1
N$15
  Top 0.305: CHRG.C R41.2
N$16
  Top 0.305: DONE.C R4.2
N$17
  Top 0.203: 53.78,4.44 U6.17 53.4,4.44 C98.1
N$18
  Top 0.203: U6.18 54.54,3.92 53.9,3.28 53.34,3.28 52.41,2.34 C40.1
N$19
  Top 0.203: U6.25 58.18,5.04 58.9,4.32 58.9,3.09 C41.1
N$20
  Top 0.203: C59.1 58.44,6.64 U6.29
N$21
  Top 0.254: TF.P1 8.86,25.64 R10.1
N$22
  Top 0.254: P2.18 79.2,26.43 C47.1
N$23
  Top 0.203: U6.30 58.25,7.04 58.95,7.75 58.95,8.2 C60.1
N$24
  Top 0.203: U6.15 53.04,5.44 52.15,4.55 C67.2
N$25
  Top 0.203: C66.2 51.78,3.5 53.33,5.04 U6.16
N$26
  Top 0.203: U6.20 55.34,3.03 C64.2
N$27
  Top 0.203: U6.31 58.07,7.44 58.5,7.87 58.5,8.78 C70.2
N$28
  Top 0.203: 17.94,24.86 R14.1
  Top 0.254: TF.P8 16.21,26.59 17.94,24.86
N$29
  Top 0.254: R35.1 11.68,25.52 D5.1
N$30
  Top 0.203: U6.19 54.94,3.6 C65.2
N$31
  Top 0.305: C84.2 5.35,25.84 L5.2 4.46,28.17 C76.1
N$32
  Top 0.203: R3.2 57.81,11 | 57.81,11 R36.2 | U6.1 57.48,8.99 57.48,10.67 57.81,11
N$33
  Top 0.203: C4.2 25.15,16.32 U3.3 U3.2 | U3.2 25.58,16.72 25.3,17 23.44,17 L2.2 | 26.64,16.34 26.64,16.7 26.54,16.7 | 26.54,16.7 26.39,16.54 | 26.54,16.7 26.47,16.7 U3.2
  Top 0.406: 26.39,16.54 25.35,16.54 25.09,16.8 23.11,16.8
N$34
  Top 0.254: USB1.B5 38.12,7.73 R31.1
N$35
  Top 0.203: U3.34 35.72,13.92 R16.2
N$36
  Top 0.203: U6.11 52.79,7.04 51.99,6.25 51.58,6.25 R40.1
N$37
  Top 0.203: U3.54 28.05,20.7 28.57,21.23 28.57,23.09 28.09,23.57 R34.2
N$38
  Top 0.203: U3.33 36.33,13.52 R18.2
N$39
  Top 0.203: C71.2 58.98,10.41 58.98,9.88 57.54,8.44 U6.32
N$40
  Top 0.203: U3.31 37.64,12.72 R23.2
N$41
  Top 0.203: U3.30 38.26,12.32 R25.2
N$42
  Top 0.254: U7.4 58.59,23.94 R39.1
N$43
  Top 0.305: MIC1.4 3.83,25.83 L5.1 2.54,27.28 C75.1
N$44
  Top 0.305: C88.1 26.8,6.26 L6.2 28.77,5.32 C91.2
N$45
  Top 0.305: MIC2.4 26.51,5.03 L6.1 25.09,5.32 C87.1
N$46
  Top 0.203: U6.27 59.63,5.84 C69.2
N$47
  Top 0.305: C100.1 62.09,4.79 L8.2 63.52,5.8 C81.2
N$48
  Top 0.254: 74.48,29.85 L7.2
  Top 0.305: C72.2 74.48,29.85 | L7.2 75.36,30.75 C95.1
N$49
  Top 0.203: U6.28 59.11,6.24 C68.2
N$50
  Top 0.203: U6.12 53.05,6.64 51.87,5.46 50.65,5.46 50.52,5.59 | 50.52,5.59 50.52,5.51 50.49,5.49 | R26.1 R38.1 arc-90 50.49,5.59 50.52,5.59
N$51
  Top 0.254: MIC3.4 73.17,31.39
  Top 0.305: 73.17,31.39 L7.1 74.47,32.64 C94.1
N$61
  Top 0.203: R5.2 R42.2 56.27,10.91 57.02,10.16 57.02,9.5 56.54,9.01 U6.2
N$63
  Top 0.203: U3.49 30.05,20.11 30.53,20.6 32.23,20.6 R12.2
N$65
  Top 0.203: U3.53 28.45,20.42 30.4,22.38 30.4,22.76 C13.2 31.02,23.38 X1.3
N$66
  Top 0.203: R34.1 C19.1 28.95,25.95 X1.1
N$67
  Top 0.254: 63.18,4.21 L8.1 63.12,4.27
  Top 0.305: C102.1 63.18,4.21 | MIC4.4 63.12,4.27
N$71
  Top 0.254: 69.01,25.35 69.01,25.13 Q12.3 68.83,25.38 68.99,25.38
  Top 0.61: Q12.3 67.59,25.13 | 67.59,25.13 64.44,25.13 L3.P$2 | C58.2 67.59,26.67 D7.A 67.61,25.15 67.59,25.13 | 67.13,25.17 67.61,25.65 67.89,25.38 68.99,25.38
PREVGH  (via drill 0.3)
  Top 0.203: D7.C
  Top 0.305: D7.C 69.61,27.92 C52.1 69.59,28.52 v69.6,28.52 | P2.21 v77.7,23.93
  Bottom 0.305: v77.7,23.93 70.23,23.93 69.6,24.56 v69.6,28.52
PREVGL  (via drill 0.3)
  Top 0.203: 67.34,29.49 C55.1
  Top 0.254: 67.3,29.49 C55.1
  Top 0.305: D6.A 67.3,29.49 | v67.89,29.49 67.34,29.49 | P2.23 v76.7,23.3 v76.71,23.29
  Bottom 0.305: v76.71,23.29 68.99,23.29 67.89,24.38 v67.89,29.49
PWDN  (via drill 0.3)
  Top 0.203: J5.17 14.01,11.82 v13.99,11.81 | v15.29,20.47 15.29,20.98 R27.1
  Bottom 0.203: v13.99,11.81 13.87,11.81 13.28,12.39 13.28,18.47 v15.29,20.47
RESE  (via drill 0.3)
  Top 0.203: P2.3 86.7,22.08 v86.69,22.07
  Top 0.305: Q12.2 69.44,22.75 R33.1 69.52,22.08 v70.1,22.08
  Bottom 0.203: v70.1,22.08 v86.68,22.08 v86.69,22.07
RESET
  Top 0.203: U3.4 19.18,15.92 15.8,19.3 9.5,19.3 R15.1
  Top 0.254: R15.1 C10.2 | C10.2 | C10.2 RST.2
SPICLK
  Top 0.203: R18.1 37.21,16.13 38.12,17.04 U4.6
SPICS0  (via drill 0.3)
  Top 0.203: U3.32 37.05,13.12 37.9,13.97 37.9,15.6 v38.08,15.77 | U4.1 40.67,24.07 42.39,22.35 42.39,16.2 v42.55,16.05
  Bottom 0.203: v38.08,15.77 42.27,15.77 v42.55,16.05
SPID
  Top 0.203: U4.5 35.97,17.68 R28.1
SPIHD
  Top 0.203: U4.7 39.6,17.48 R25.1
SPIQ  (via drill 0.3)
  Top 0.203: U4.2 39.4,24.63 41.94,22.1 v41.94,15.16 | R16.1 36.3,15.38 v36.3,15.82
  Bottom 0.203: v36.3,15.82 36.96,15.16 v41.94,15.16
SPIWP  (via drill 0.3)
  Top 0.203: U4.3 38.13,25.24 41.48,21.89 41.48,16.51 v41.35,16.38 | v38.89,16.38 38.89,14.85 R23.1
  Bottom 0.203: v38.89,16.38 v41.35,16.38
U0RXD  (via drill 0.3)
  Top 0.203: U3.50 29.65,20.32 30.38,21.06 31.45,21.06 v31.57,21.18 v31.57,21.19 RX.T | R39.2 60.3,23.6 v60.66,23.6
  Bottom 0.203: v31.57,21.18 58.24,21.18 v60.66,23.6
U0TXD
  Top 0.203: R12.1 33.23,21.81 TX.T
USB_D+
  Top 0.203: 36.77,7.78 R21.2
  Top 0.254: USB1.A6 36.12,7.26 36.77,7.92 R21.2 | USB1.B6 37.12,7.43 36.77,7.78
USB_D-
  Top 0.203: USB1.A7
  Top 0.254: USB1.A7 36.62,5.43 36.45,5.25 35.89,5.25 35.62,5.52 USB1.B7 35.62,7.92 R20.2
V_BATT  (1 unrouted)
  Top 0.203: U1.3 52.5,22.12 51.36,22.12 50.88,21.64 50.88,21.89 51.26,22.28 52.78,22.28 52.78,22.71 51.36,22.71 51.08,22.99 51.08,22.43 | 50.88,20.4 50.93,20.4 51.54,19.79 51.03,19.79 U2.5
  Top 0.254: U1.3 U1.2 50.91,22.67 C6.1
  Top 0.406: 51.08,22.43 52.63,22.43
  Top 0.61: Q1.3 50.98,19.74 U2.5 50.88,19.64 C36.1 C6.1 | 50.91,22.67 50.91,24.33 BAT.+
VCOM
  Top 0.254: P2.24 76.2,26.61 C51.1
VDD_CAM  (via drill 0.3)
  Top 0.203: J5.14 16.34,10.32 v19.2,13.18 | Q3.3
  Top 0.61: Q3.3 v57.81,29.26 58.04,29.49 C30.2 C27.2 60.83,29.6 | U10.3 60.58,33.47 60.68,33.38 | 60.68,33.38 60.83,33.22 60.83,32.41 | 60.83,32.41 60.83,31.7 | 60.83,31.7 60.83,31.01 | 60.83,30.63 60.83,29.6 | U10.1 60.71,31.57 60.83,31.7 | U16.1 61.04,32.21 60.83,32.41 | C28.2 60.68,33.38 | U16.3 61.8,30.06 C29.2 61.32,29.6 60.83,29.6 | 60.2,29.54 60.98,30.33 62.31,30.33 61.85,29.87 61.09,29.87 61.47,30.25 | 61.47,30.25 61.65,30.25 | 61.47,30.25 61.21,30.25 60.83,30.63 | 60.83,30.63 60.83,31.01 | 60.83,31.01 60.33,31.52 60.45,31.52 61.32,32.38 62.33,32.38 62.05,32.66 C28.2 61.92,33.5 60.81,33.5 | 60.05,33.5 60.81,33.5 | 60.81,33.5 61.21,33.1 61.21,32.54 61.32,32.54 61.75,32.97
  Bottom 0.203: v19.2,13.18 27.94,13.18 29.97,15.21 29.97,21.97 30.23,22.23 55.45,22.23 56.72,23.5 56.72,28.17 v57.81,29.26
VDD_SPI
  Top 0.203: U3.29 39.78,11.92 C12.2 C22.1 U4.8
VMIC12  (via drill 0.3)
  Top 0.203: U6.24 57.96,4.44 58.5,3.91 58.5,2.15 v58.72,1.93 | v58.72,1.93 C63.2 | v58.72,1.93 v58.73,1.93
  Top 0.254: C73.1 C74.1
  Top 0.305: MIC2.1 27.3,2.89 C73.1 v27.82,3.75 v27.81,3.76 | MIC1.1 4.65,24.78 C86.1 5.79,24.78 | 5.79,24.78 C85.1 | v5.79,24.84 5.79,24.78
  Bottom 0.305: v58.73,1.93 53.77,1.93 52.02,3.68 27.89,3.68 v27.81,3.76 27.74,3.68 26.06,3.68 22.84,6.91 11.68,6.91 5.79,12.8 v5.79,24.84
VMIC34  (via drill 0.3)
  Top 0.203: U6.26 58.96,5.44 59.27,5.14 | 59.27,5.14 C99.1 59.61,4.7 | 72.37,29.46 v72.36,29.46 | 59.18,5.05 59.27,5.14
  Top 0.254: v59.18,5.03 59.18,5.05
  Top 0.305: MIC4.1 v65.48,5.16 C92.1 C62.2 | 72.37,29.46 C78.1 C93.1 72.37,30.45 71.6,31.22 MIC3.1 | v72.29,26.92 72.29,13.31 70.1,11.12 v65.48,11.12
  Bottom 0.203: 65.43,5.11 v65.48,5.16
  Bottom 0.254: 65.35,5.03 v65.48,5.16 | v65.48,11.12
  Bottom 0.305: v72.29,26.92 72.29,29.39 v72.36,29.46 | v59.18,5.03 64.8,5.03 65.05,5.03 | 65.05,5.03 65.35,5.03 | v65.48,5.16 v65.48,11.12 | 65.05,5.03 65.48,5.46
VPWR  (2 unrouted)
  Top 0.61: D2.- 54.58,17.02 | 54.58,17.02 54.58,17.37 Q1.2 | U13.3 55.35,17.24 | 55.35,17.24 54.8,17.24 54.58,17.02 | 55.35,17.24 55.61,17.5 C106.1 56.62,18.73 C16.2 | C16.2 C24.2 57.77,18.6 U13.1 59.45,17.24 U5.3 59.49,16.65 C39.1 C38.2 | U5.1 58.56,19.19 58.09,18.72 C16.2 | 59.99,16.1 59.99,17.12 59.79,17.32 59.79,16.99 58.95,16.15 58.09,17.02 58.73,17.02 59.18,16.56 | 58.06,18.67 58.06,17.6 58.6,17.07 58.32,17.07 57.89,17.5 57.89,18.21 57.45,18.64 56.16,18.64 55.91,18.39 55.91,16.97 55.22,16.97 54.61,16.36 54.61,17.68 54.51,17.78 55.19,17.78 55.52,18.11

## Text on the board
tPlace: - | +
bPlace: MaTouch ESP32-S37.5" | Eink AI Mic Arrary V1.0 | www.makerfabs.com